# Altium schematic sheet PowerSuply.SchDoc
size A4
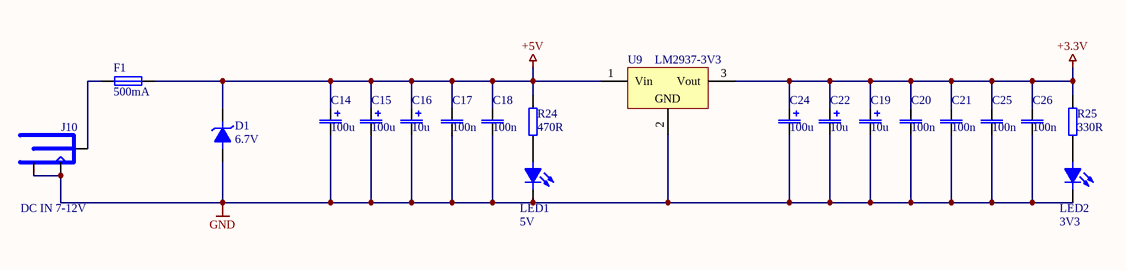
[diagram p0: PowerSuply.SchDoc]

## Parts
C14  100u  [D8 ELKO]
C15  100u  [D8 ELKO]
C16  10u  [CAP 1210]
C17  100n  [CAP 0805]
C18  100n  [CAP 0805]
C19  10u  [CAP 1210]
C20  100n  [CAP 0805]
C21  100n  [CAP 0805]
C22  10u  [CAP 1210]
C24  100u  [D8 ELKO]
C25  100n  [CAP 0805]
C26  100n  [CAP 0805]
D1  6.7V  [SMA]
F1  500mA  [FUSE1812]
J10  DC IN 7-12V  [DC POWER CONNECTOR]
LED1  5V  [LED 0805G]
LED2  3V3  [LED 0805G]
R24  470R  [RES 0805]
R25  330R  [RES 0805]
U9  LM2937-3V3  [SOT223]

## Nets
+3.3V: C19.1(+) C20.2 C21.2 C22.1(+) C24.1(+) C25.2 C26.2 R25.2 U9.3(Vout)
+5V: C14.1(+) C15.1(+) C16.1(+) C17.2 C18.2 D1.2(K) F1.2 R24.2 U9.1(Vin)
GND: C14.2(-) C15.2(-) C16.2(-) C17.1 C18.1 C19.2(-) C20.1 C21.1 C22.2(-) C24.2(-) C25.1 C26.1 D1.1(A) J10.2(GND) J10.3(GND) LED1.2(K) LED2.2(K) U9.2(GND)
NetF1_1: F1.1 J10.1(9V)
NetLED1_1: LED1.1(A) R24.1
NetLED2_1: LED2.1(A) R25.1

## Library data of the parts
C14-C16 C19 C22 C24 = CAP_POL: POLARIZED CAPACITOR; Supplier: LOMEX
  C14 C15 C24: Reference: 91-00-90; VALUE: 100u
  C16 C19 C22: Reference: 92-01-13; VALUE: 10u
C17 C18 C20 C21 C25 C26 = CAP: NON POLARIZED CAPACITOR; VALUE: 100n; Reference: 82-01-25; Supplier: LOMEX
D1 = SUPRESSOR DIODE: Reference: 96-00-75; VALUE: 6.7V; Supplier: LOMEX
F1 = FUSE: Reference: 44-02-32; VALUE: 500mA; Supplier: LOMEX
J10 = DC POWER CONN: DC POWER CONNECTOR 5.5/2.1/9.5mm; Supplier: LOMEX; Reference: 43-07-67; VALUE: DC IN 7-12V
LED1 LED2 = LED: Reference: 95-01-09; Supplier: LOMEX
  LED1: VALUE: 5V
  LED2: VALUE: 3V3
R24 R25 = RES: RESISTOR; Reference: 81-10-83; Supplier: LOMEX
  R24: VALUE: 470R
  R25: VALUE: 330R
U9 = LM2937: SOT223; Name: LM2937-3V3; Datasheet: http://www.ti.com/lit/ds/symlink/lm2937.pdf